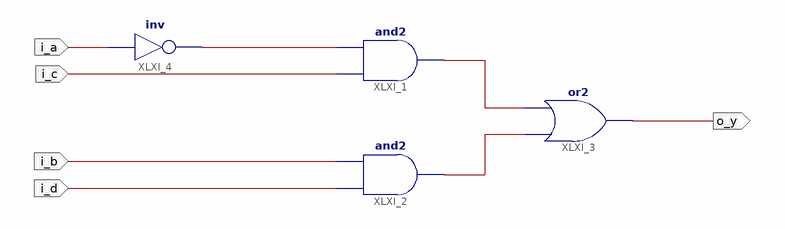
[diagram p0: schematic sheet 1]
// Xilinx ISE schematic Laby4bpod.sch (spartan3e) as structural Verilog: 4 symbols, 5 ports
module Laby4bpod (
  input  i_c,
  input  i_b,
  input  i_d,
  input  i_a,
  output o_y
);

  wire XLXN_1, XLXN_2, XLXN_6;

  and XLXI_1 (XLXN_2, i_c, XLXN_6);
  and XLXI_2 (XLXN_1, i_d, i_b);
  or XLXI_3 (o_y, XLXN_1, XLXN_2);
  not XLXI_4 (XLXN_6, i_a);
endmodule
